# Altium schematic sheet Connectors.SchDoc: Renesas Public Template
size A3; Author: M. Merrill; Company Name: Renesas Electronics America; Organization: Renesas Electronics; Address1: 915 Murphy Ranch Road; Address2: Milpitas, CA  95035; DocumentNumber: 3; Revision: 01; SheetNumber: 2; SheetTotal: 2; CompanyURL: www.renesas.com; PageSetup: Record=PageOptions|CenterHorizontal=True|CenterVertical=True|PrintScale=1.00|XCorrection=1.00|YCorrection=1.00|PrintKind=1|BorderSize=5000000|LeftOffset=0|BottomOffset=0|Orientation=2|PaperLength=1000|PaperWidth=1000|Scale=100|PaperSource=7|PrintQuality=-4|MediaType=1|DitherType=10|PaperKind=A5 148x210mm|PrintScaleMode=1
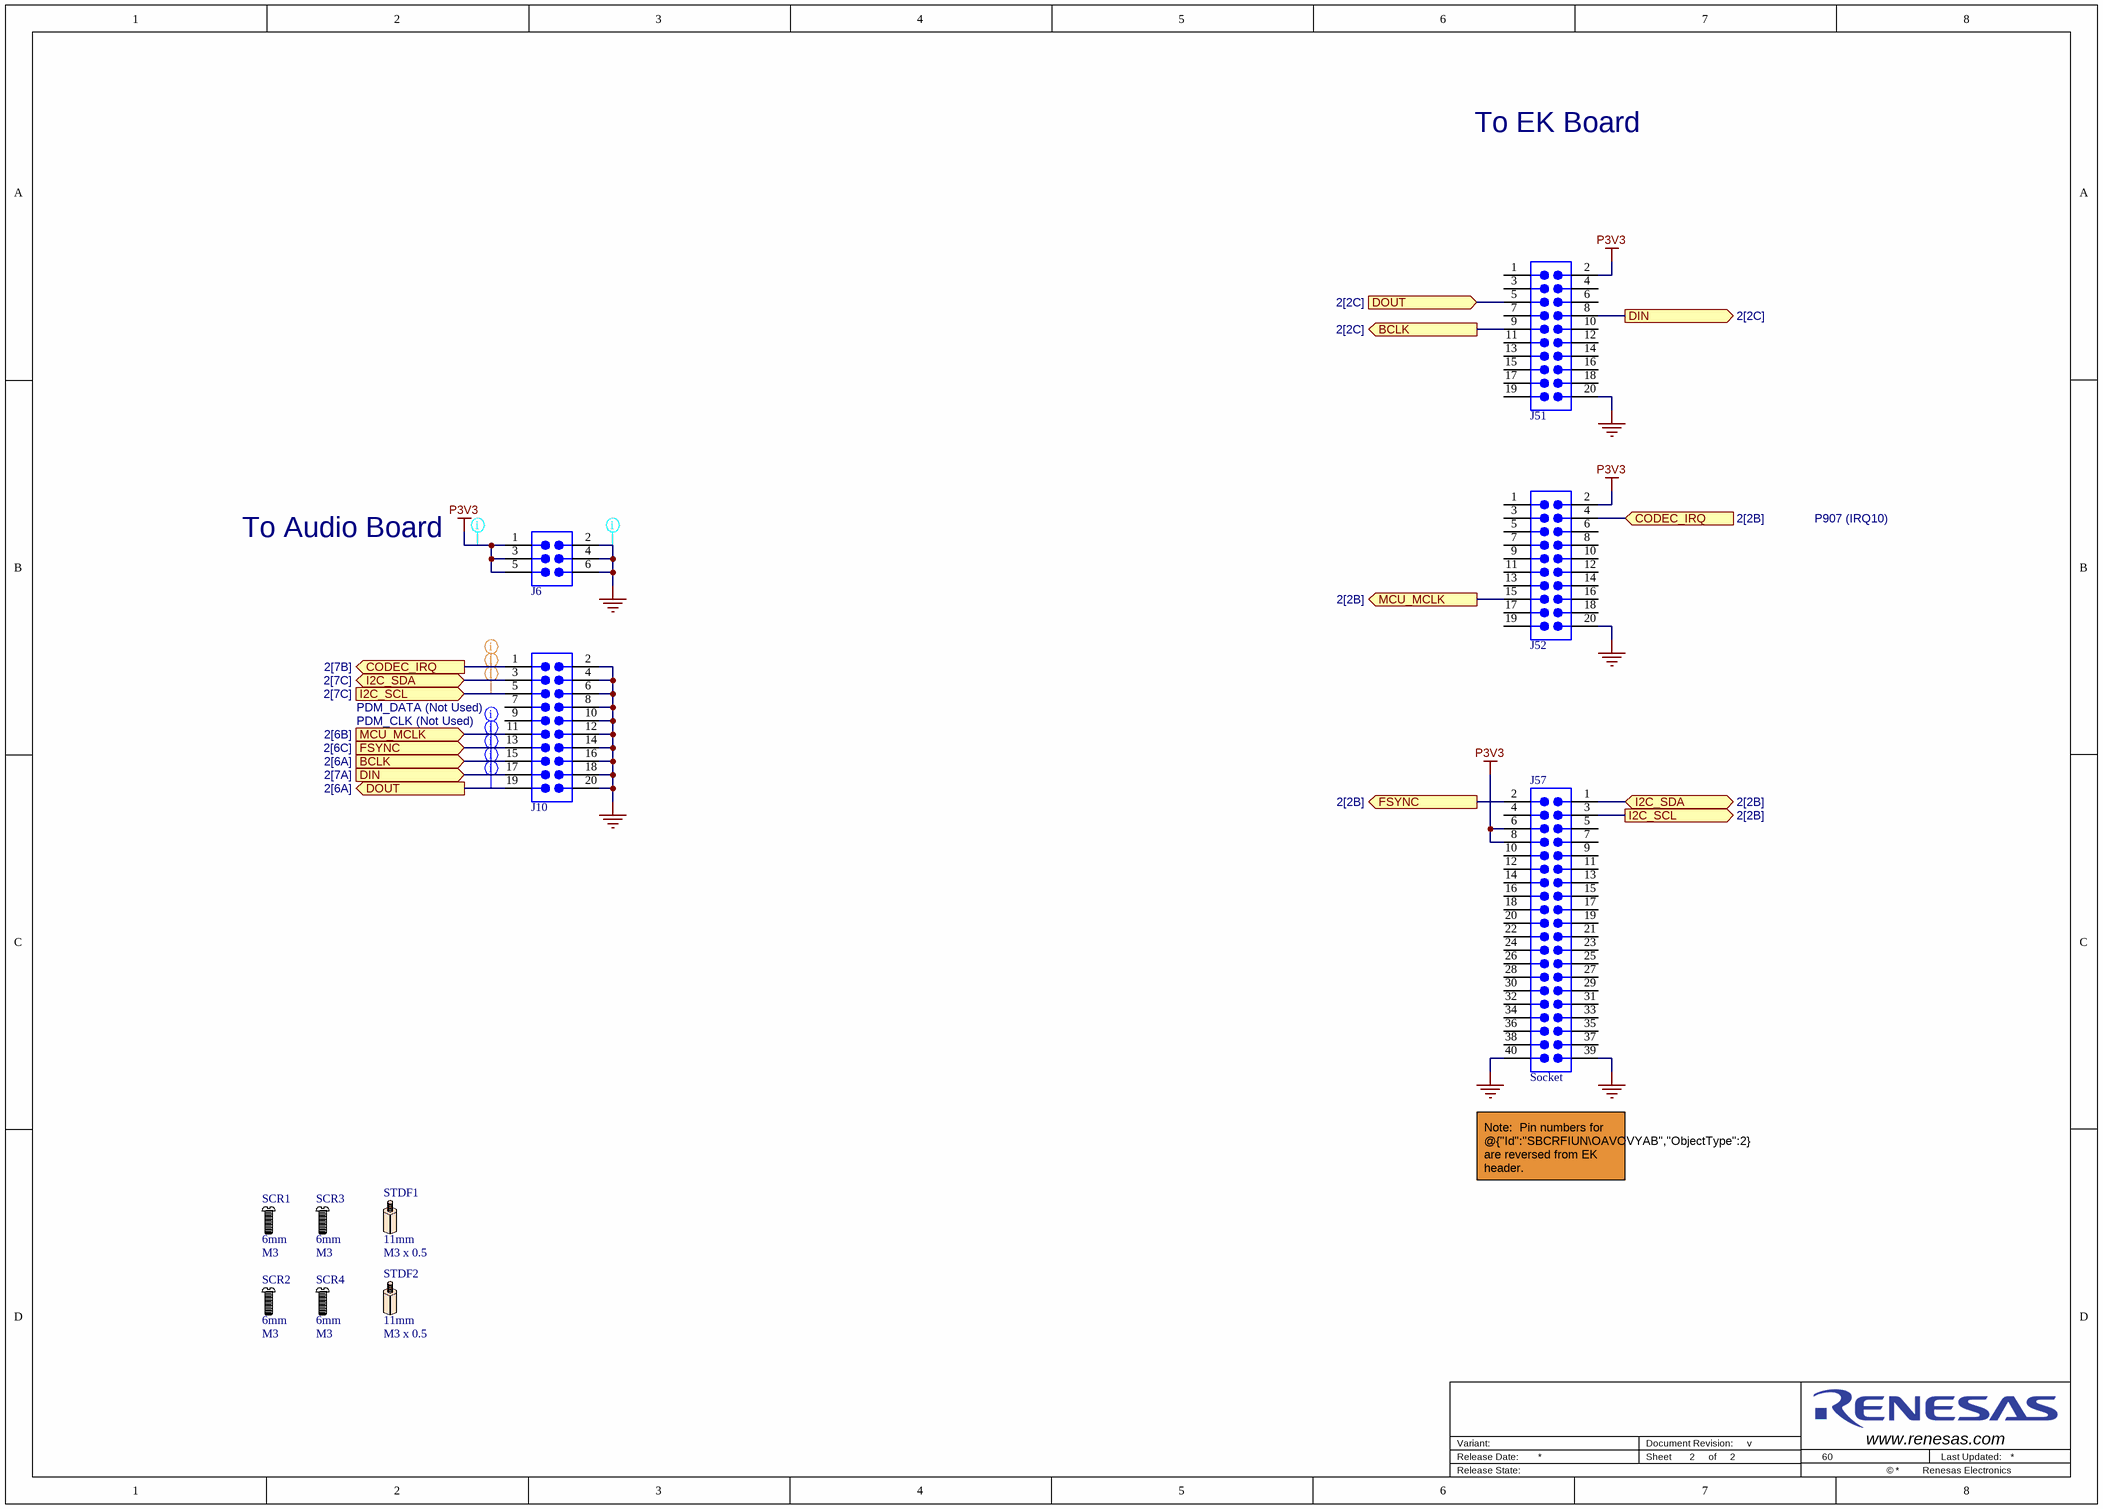
[diagram p0: Connectors.SchDoc]

## Parts
J6  CON-100143-01  [Wurth_61300621821_REVERSE_PINS]  (value not drawn)
J10  CON-100144-01  [Wurth_61302021821_REVERSE_PINS]  (value not drawn)
J51  CON-100144-01  [Wurth_61302021821_REVERSE_PINS_DOT_ONLY]  (value not drawn)
J52  CON-100144-01  [Wurth_61302021821_REVERSE_PINS_DOT_ONLY]  (value not drawn)
J57  Gender: Socket  [Wurth_61304021821]  (hidden comment: CON-100091-01)
SCR1  Length: 6mm  Thread: M3  [KEYSTONE_SCREW_M3_6mm]  (hidden comment: SCR-100002-01)  (mechanical)
SCR2  Length: 6mm  Thread: M3  [KEYSTONE_SCREW_M3_6mm]  (hidden comment: SCR-100002-01)  (mechanical)
SCR3  Length: 6mm  Thread: M3  [KEYSTONE_SCREW_M3_6mm]  (hidden comment: SCR-100002-01)  (mechanical)
SCR4  Length: 6mm  Thread: M3  [KEYSTONE_SCREW_M3_6mm]  (hidden comment: SCR-100002-01)  (mechanical)
STDF1  Length: 11mm  Thread: M3 x 0.5  [Essentra_STDF_MF_M3_11mm_reverse]  (hidden comment: 36M30MF011)  (mechanical)
STDF2  Length: 11mm  Thread: M3 x 0.5  [Essentra_STDF_MF_M3_11mm_reverse]  (hidden comment: 36M30MF011)  (mechanical)

## Ports
BCLK (in, see 2[6A]), BCLK (out, see 2[2C]), CODEC_IRQ (in, see 2[2B]), CODEC_IRQ (out, see 2[7B]), DIN (in, see 2[7A]), DIN (out, see 2[2C]), DOUT (in, see 2[2C]), DOUT (out, see 2[6A]), FSYNC (in, see 2[6C]), FSYNC (out, see 2[2B]), I2C_SCL (in, see 2[7C]), I2C_SCL (out, see 2[2B]), I2C_SDA (bidir, see 2[2B]), I2C_SDA (bidir, see 2[7C]), MCU_MCLK (in, see 2[6B]), MCU_MCLK (out, see 2[2B])

## Nets
GND: J6.2 J6.4 J6.6 J10.2 J10.4 J10.6 J10.8 J10.10 J10.12 J10.14 J10.16 J10.18 J10.20 J51.20 J52.20 J57.39 J57.40
P3V3: J6.1 J6.3 J6.5 J51.2 J52.2 J57.6 J57.8
BCLK: J10.15 J51.9 ; port BCLK
CODEC_IRQ: J10.1 J52.4 ; port CODEC_IRQ
DIN: J10.17 J51.8 ; port DIN
DOUT: J10.19 J51.5 ; port DOUT
FSYNC: J10.13 J57.2 ; port FSYNC
I2C_SCL: J10.5 J57.3 ; port I2C_SCL
I2C_SDA: J10.3 J57.1 ; port I2C_SDA
MCU_MCLK: J10.11 J52.15 ; port MCU_MCLK

Not connected (* = marked no-connect by the designer): J10 7 9; J51 1 3 4 6 7 10 11 12 13 14 15 16 17 18 19; J52 1 3 5 6 7 8 9 10 11 12 13 14 16 17 18 19; J57 4 5 7 9 10 11 12 13 14 15 16 17 18 19 20 21 22 23 24 25 26 27 28 29 30 31 32 33 34 35 36 37 38

## Layout directives
net class Power; rule Supply Nets [Voltage = 3.300]: P3V3
net class Power; rule Supply Nets [Voltage = 0.000]: GND
net class I2S, Digital: BCLK, DIN, DOUT, FSYNC, MCU_MCLK
net class Digital: CODEC_IRQ, I2C_SCL, I2C_SDA

## Notes on the sheet
- To EK Board
- P907 (IRQ10)
- To Audio Board
- PDM_DATA (Not Used)
- PDM_CLK (Not Used)
- Note:  Pin numbers for @{"Id":"SBCRFIUN\OAVOVYAB","ObjectType":2} are reversed from EK header.
- Variant:
- Release Date:
- Document Revision:
- Sheet
- of
- v
- 60
- www.renesas.com <http://www.renesas.com>
- Last Updated:
- Release State:
- ©
- Renesas Electronics

## Library data of the parts
J6 = CON-100143-01: Wurth Socket 2.54mm pitch 6pos 2x3, 3.1mm tail, 8.5mm body, gold plate; Manufacturer: Wurth Elektronik; Mfg Part Number: 61300621821; Positions: 6; System: Connector; Pitch: 2.54mm; Mfg: Wurth Elektronik; PN: 61300621821; Manufacturer 1: Wurth Elektronik; Supplier 1: Newark; Supplier Part Number 1: 61300621821; Manufacturer Part Number 1: 61300621821; Supplier 2: DigiKey; Supplier Part Number 2: 732-61300621821-ND; Supplier 3: Mouser; Supplier Part Number 3: 710-61300621821
J10 J51 J52 = CON-100144-01: Wurth Socket 2.54mm pitch 20pos 2x10, 3.1mm tail, 8.5mm body, gold plate; Manufacturer: Wurth Elektronik; Mfg Part Number: 61302021821; Positions: 20; System: Connector; Pitch: 2.54mm; Manufacturer 1: Wurth Elektronik; Manufacturer Part Number 1: 61302021821; Mfg: Wurth Elektronik; PN: 61302021821; Supplier 1: Newark; Supplier Part Number 1: 61302021821; Supplier 2: DigiKey; Supplier Part Number 2: 732-61302021821-ND; Supplier 3: Mouser; Supplier Part Number 3: 710-61302021821
J57 = CON-100091-01: Wurth Socket Header 2.54mm pitch 40pos 2x20 TH; Mfg Part Number: 61304021821; Legacy Part Number: 160-10004309; Mfg: Wurth Elektronik; Positions: 40; System: Connector; Pitch: 2.54mm; Manufacturer 1: Wurth Elektronik; Manufacturer Part Number 1: 61304021821; Manufacturer: Wurth Elektronik; PN: 61304021821; Supplier 1: Newark; Supplier Part Number 1: 47AC7191; Supplier 2: Mouser; Supplier Part Number 2: 710-61304021821; Supplier 3: Digikey; Supplier Part Number 3: 732-61304021821-ND; Supplier 4: Farnell; Supplier Part Number 4: 2827916
SCR1-SCR4 = SCR-100002-01: Screw, Nylon, PH, M3 6mm Slotted; Manufacturer: Keystone Electronics; Mfg Part Number: 29341; Manufacturer 1: Keystone Electronics; Manufacturer Part Number 1: 29341; Supplier 1: Digi-Key; Supplier Part Number 1: 36-9327-ND; Mfg: Keystone Electronics; PN: 29341
STDF1 STDF2 = STDF-100017-01: Standoff, Nylon, M3 Hex, Male-Fem, 11mm; Manufacturer: Essentra Components; Manufacturer 1: Essentra Components; Mfg Part Number: 36M30MF011; Manufacturer Part Number 1: 36M30MF011; Mfg: Essentra Components; PN: 36M30MF011; Supplier 1: DigiKey; Supplier Part Number 1: 145-36M30MF011-ND; Supplier 2: Mouser; Supplier Part Number 2: 144-36M30MF011